# Altium schematic sheet Lipo_Power.SchDoc
size A
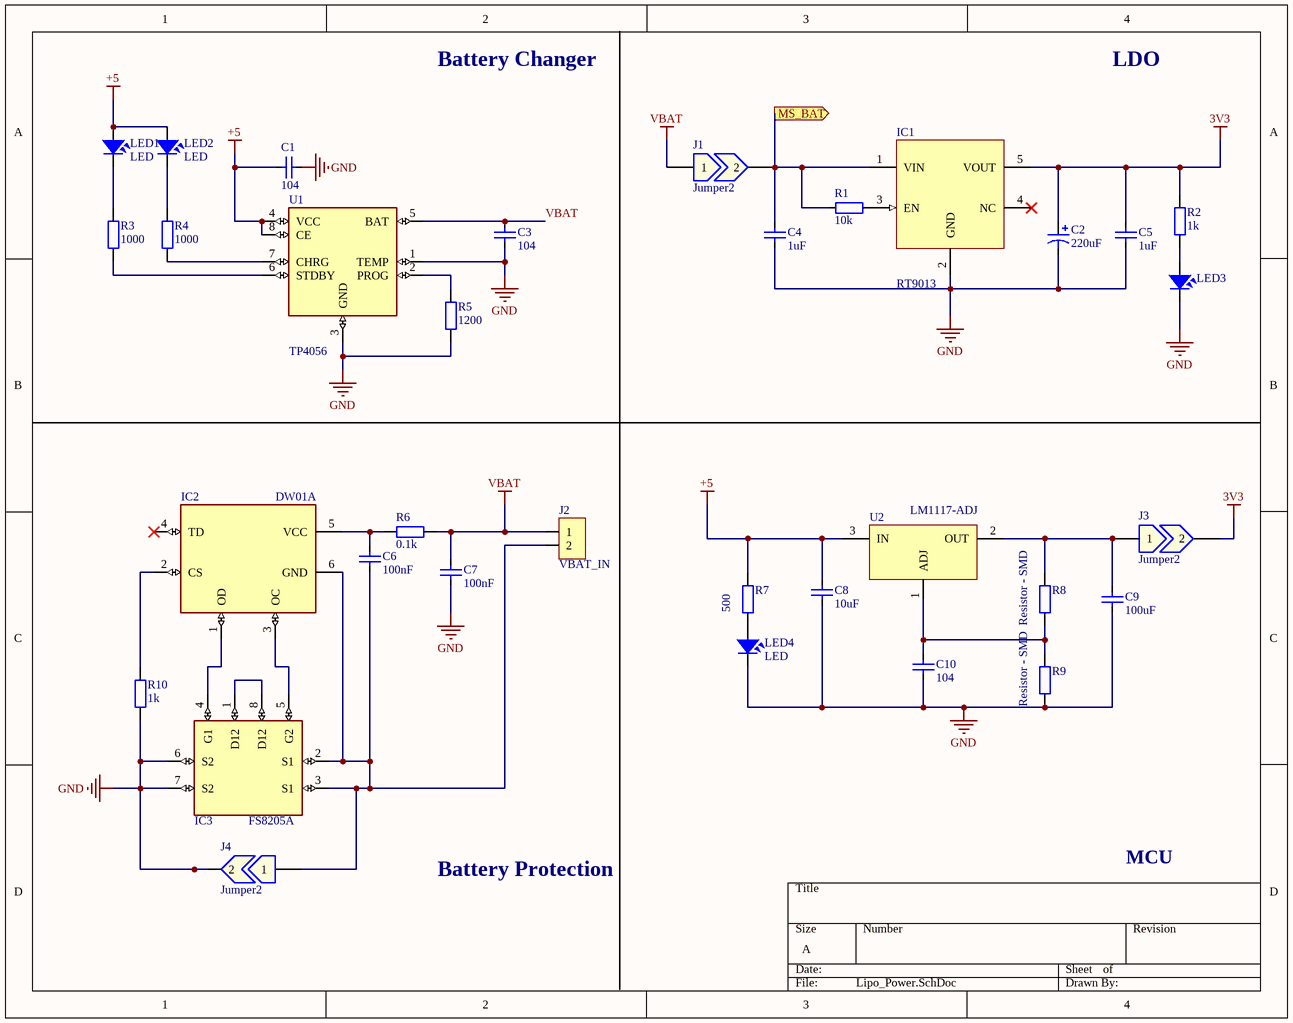
[diagram p0: Lipo_Power.SchDoc]

## Parts
C1  104  [CAP_0805]
C2  220uF  [CAP_TANTALUM_3216]
C3  104  [CAP_0805]
C4  1uF  [CAP_0805]
C5  1uF  [CAP_0805]
C6  100nF  [CAP_0805]
C7  100nF  [CAP_0805]
C8  10uF  [CAP_0805]
C9  100uF  [CAP_0805]
C10  104  [CAP_0805]
IC1  RT9013  [SOT23-5]
IC2  DW01A  [SOT23-6]
IC3  FS8205A  [FS8205A]
J1  Jumper2  [JUMPER2]
J2  VBAT_IN  [JP2-D1T]
J3  Jumper2  [RES-SMD-0201]
J4  Jumper2  [RES-SMD-0201]
LED1  LED  [LED-0805-Red]
LED2  LED  [LED-0805-Blue]
LED3  (no value)  [LED-0805-Red]
LED4  LED  [LED-0805-Red]
R1  10k  [RES-SMD-0805]
R2  1k  [RES-SMD-0805]
R3  1000  [RES-SMD-0805]
R4  1000  [RES-SMD-0805]
R5  1200  [RES-SMD-0805]
R6  0.1k  [RES-SMD-0805]
R7  500  [RES-SMD-0805]
R8  Resistor - SMD  [RES-SMD-0805]
R9  Resistor - SMD  [RES-SMD-0805]
R10  1k  [RES-SMD-0805]
U1  TP4056  [TP4056]
U2  LM1117-ADJ  [LM1117-SOP]

## Ports
MS_BAT (out)

## Nets
3V3: C2.1 C5.1 IC1.5(VOUT) J3.2 R2.2
+5: C1.1 C8.1 LED1.1 LED2.1 R7.1 U1.4(VCC) U1.8(CE) U2.3(IN)
GND: C1.2 C2.2 C3.1 C4.2 C5.2 C7.1 C8.2 C9.1 C10.1 IC1.2(GND) IC3.6(S2) IC3.7(S2) J4.2 LED3.2 LED4.2 R5.2 R9.2 R10.2 U1.1(TEMP) U1.3(GND)
VBAT: C3.2 C7.2 J1.1 J2.1 R6.2 U1.5(BAT)
MS_BAT: C4.1 IC1.1(VIN) J1.2 R1.2 ; port MS_BAT
NetC6_1: C6.1 IC2.6(GND) IC3.2(S1) IC3.3(S1) J2.2 J4.1
NetC6_2: C6.2 IC2.5(VCC) R6.1
NetC9_2: C9.2 J3.1 R8.1 U2.2(OUT)
NetC10_2: C10.2 R8.2 R9.1 U2.1(ADJ)
NetIC1_3: IC1.3(EN) R1.1
NetIC2_1: IC2.1(OD) IC3.4(G1)
NetIC2_2: IC2.2(CS) R10.1
NetIC2_3: IC2.3(OC) IC3.5(G2)
NetIC3_1: IC3.1(D12) IC3.8(D12)
NetLED1_2: LED1.2 R3.1
NetLED2_2: LED2.2 R4.1
NetLED3_1: LED3.1 R2.1
NetLED4_1: LED4.1 R7.2
NetR3_2: R3.2 U1.6(STDBY)
NetR4_2: R4.2 U1.7(CHRG)
NetR5_1: R5.1 U1.2(PROG)

Not connected (* = marked no-connect by the designer): IC1 4(NC)*; IC2 4(TD)*

## Notes on the sheet
- Battery Changer
- LDO
- Battery Protection
- MCU

## Library data of the parts
C1 C3-C10 = CapSMD: Capacitor; Value: 33p; Published: 8-Jun-2000; LatestRevisionDate: 17-Jul-2002; LatestRevisionNote: Re-released for DXP Platform.; PackageReference: RAD-0.3; Publisher: Altium Limited
C2 = Cap Pol: Polarized Capacitor (Axial); Published: 8-Jun-2000; LatestRevisionDate: 17-Jul-2002; LatestRevisionNote: Re-released for DXP Platform.; PackageReference: POLAR0.8; Publisher: Altium Limited
IC1 = RT9013: https://linhkien.cxt.vn/5435-rt9013-33gb-ic-reg-linear-33v-500ma-sot23-5.html
IC2 = DW01A: One Cell Lithium-ion/Polymer Battery Protection IC
J1 J3 J4 = Jumper2: Jumper, 2-Pin
J2 = JP2: WR-PHD 2.54 mm Angled Socket Header; Manufacturer: W¨¹rth Elektronik eiSos GmbH; partNo: 613002143121; ComponentLink1 Description: Manufacturer; ComponentLink2 Description: Datasheet; NoPins: 02; Created Date: 29 March 2013; ComponentLink1URL: http://www.we-online.com; ComponentLink2URL: http://katalog.we-online.de/em/datasheet/6130xx143121.pdf; Created by: Karrer Zheng
LED1-LED4 = LED: LED Single colour Green and Red; Value: LED 3 ly Single Colour
R1 = Resistor - SMD: Resistor; Manufacturer: Generic Components; Class: Passive; Published: 08/06/2000; Publisher: Altium Hobart Technology Centre
R2-R10 = Resistor - SMD: Resistor SMD; Manufacturer: Generic Components; Class: Passive; Published: 08/06/2000; Publisher: Altium Hobart Technology Centre
U1 = TP4056: Complete single cell Li-Ion battery with a constant current / constant voltage linear charger
U2 = LM1117-ADJ: 800mA Low-Dropout Linear Regulator; Creator: Nguyen Ba Bien; Website: http://group3i.net